# EAGLE board Motor_Board-Rev5.2.b (EAGLE 6.2), part 1 of 2
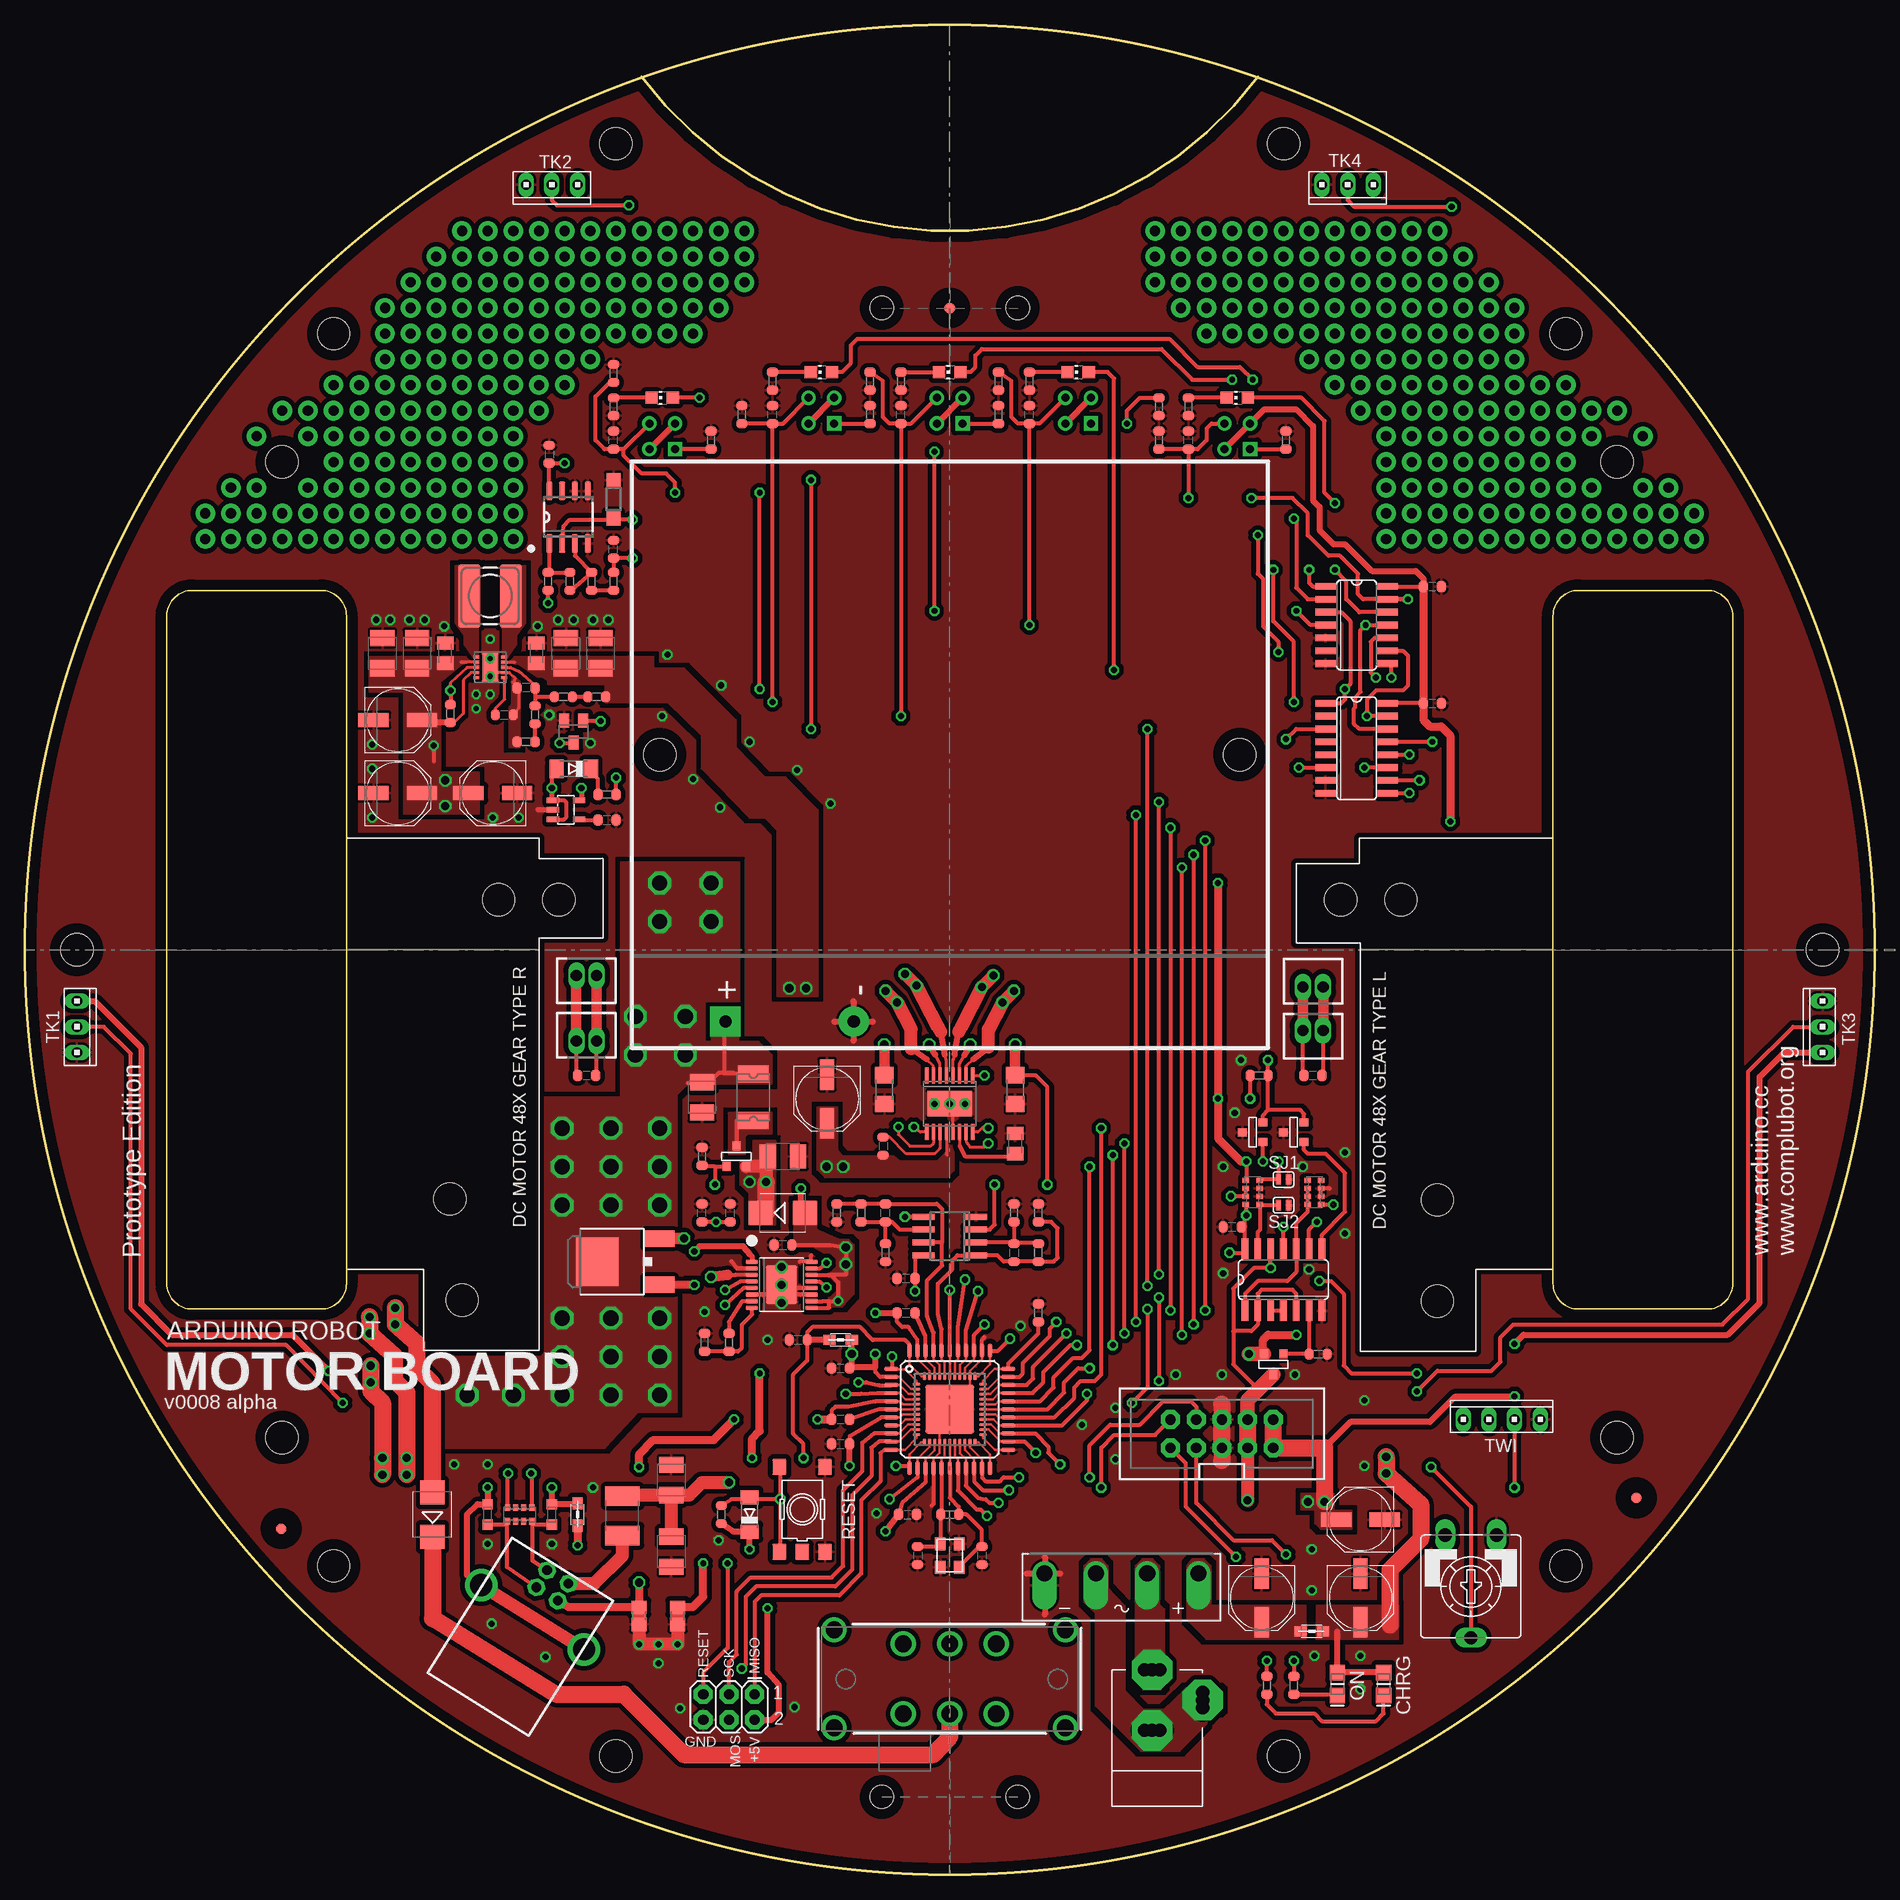
[diagram p2: board, top side]
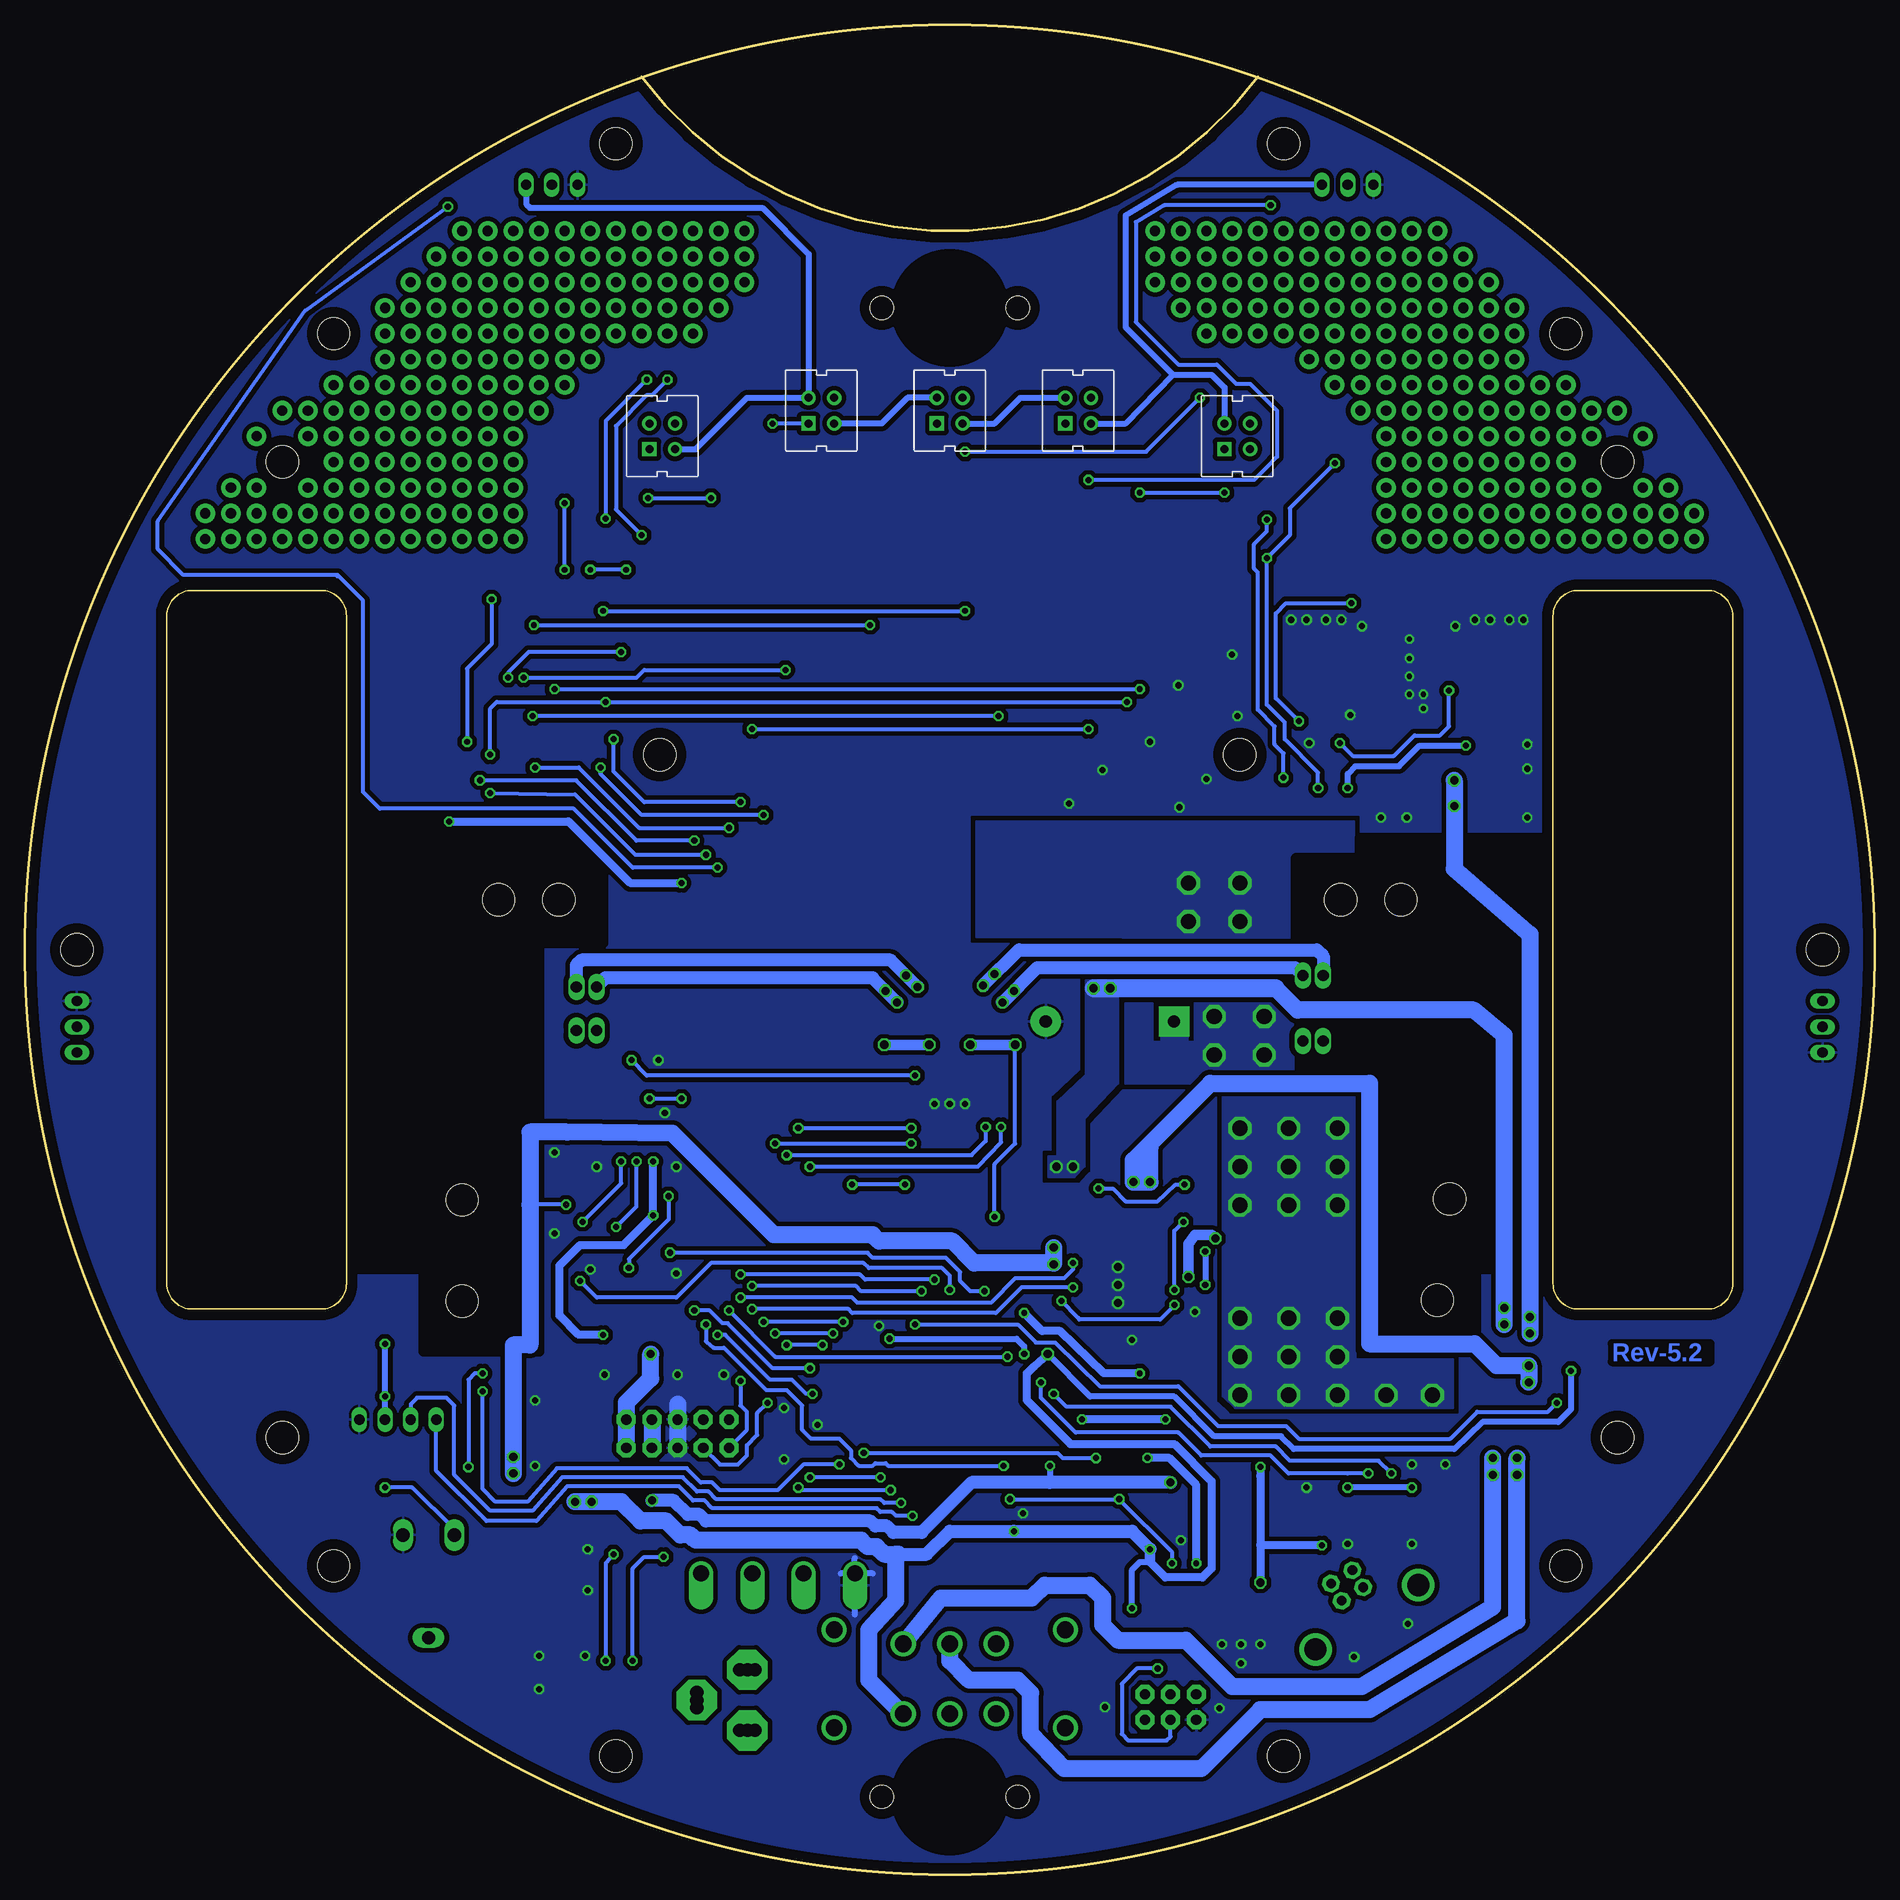
[diagram p3: board, bottom side, seen from below]

Size 182.94 x 182.94 mm. Coordinates in mm from the lower left corner, seen from the top.
Outline: 121.95,177.83 arc-106 60.99,177.83
Outline: circle at 91.47,91.47 radius 91.47
Copper layers (1*16): Top 0.035mm / dielectric 1.5mm / Bottom 0.035mm
Design rules: minimum track width 10mil, minimum drill 23mil, track to track 8mil, track to pad 8mil, pad to pad 8mil, via to via 10mil, smd to smd 8mil, copper to edge 40mil, drill to drill 8mil, minimum pad ring 10mil, minimum via ring 8mil, stop-mask expansion 2mil, vias tented up to drill 30mil, thermal gap 10mil
Net classes: 0 default: width 0.254 mm, drill 0.584 mm, clearance 0.203 mm; 1 power: width 0.254 mm, drill 0.584 mm, clearance 0.203 mm; 2 gnd: width 0.254 mm, drill 0.584 mm, clearance 0.203 mm; 3 usbvcc: width 0.254 mm, drill 0.584 mm, clearance 0.203 mm; 5 +5v: width 0.254 mm, drill 0.584 mm, clearance 0.203 mm
tRestrict: area 45.4,124 to 46.6,129.4; area 45.4,123.9 to 46.6,129.3; area 87.2,41.6 to 93.2,50.4; area 90.6,41.6 to 95.9,50.4; 5 lines

## Footprints (pad centres in the part's own frame; a part is rotated, then mirrored left to right if it is on the bottom)
KBL = drill 1.6 offset: + -7.62,-1.27; - 7.62,-1.27; AC1 2.54,-1.27; AC2 -2.54,-1.27
BALL_BEARING_LOTTIE_LEMON = hole 2.286: -6.731,0; 6.731,0
C0603-ROUND = smd 0.898 x 1.1: 1 -0.889,0; 2 0.889,0
PANASONIC_D = smd 3 x 1.4: + 2.4,0; - -2.4,0
C0805K = smd 1.3 x 1.6: 1 -1,0; 2 1,0
SMC_B = smd 1.6 x 2.4: + -1.5,0; - 1.5,0
SMD_LED0805 = smd 1.524 x 1.524: 1 0,0; 2 2.286,0
MINIMELF = smd 1.4 x 1.8: A 1.7,0; C -1.7,0
SMB = smd 2.4 x 2.4: A 2.2,0; C -2.2,0
SOD123 = smd 1.4 x 1.4: A 1.9,0; C -1.9,0
L1812 = smd 1.9 x 3.4: 1 -1.95,0; 2 1.95,0
FIDUCIA-MOUNT = smd 1.016 x 1.016: P$1 0,0
MF-MSMF-S2 = smd 1.7 x 3: P$1 -2.3,0; P$2 2.3,0
4 = drill 0.8 pad 1.422: A -1.27,1.27; C 1.27,-1.27; E 1.27,1.27 | drill 0.8 pad 1.422 square: K -1.27,-1.27
4XAA_BATTERY-HOLDER = drill 1.2 pad 3 square: 1 26.4,-22.2 | drill 1.2 pad 3: 2 26.4,-9.5 | hole 3.2: 0,28.7; 0,-28.7
SO14 = smd 0.66 x 2.032: 1 -3.81,-3.073; 2 -2.54,-3.073; 3 -1.27,-3.073; 4 0,-3.073; 5 1.27,-3.073; 6 2.54,-3.073; 7 3.81,-3.073; 8 3.81,3.073; 9 2.54,3.073; 10 1.27,3.073; 11 0,3.073; 12 -1.27,3.073; 13 -2.54,3.073; 14 -3.81,3.073
R-PDSO-G16 = smd 0.3 x 1.6: P$1 -2.275,-2.8; P$2 -1.625,-2.8; P$3 -0.975,-2.8; P$4 -0.325,-2.8; P$5 0.325,-2.8; P$6 0.975,-2.8; P$7 1.625,-2.8; P$8 2.275,-2.8; P$9 2.275,2.8; P$10 1.625,2.8; P$11 0.975,2.8; P$12 0.325,2.8; P$13 -0.325,2.8; P$14 -0.975,2.8; P$15 -1.625,2.8; P$16 -2.275,2.8 | smd 4.4 x 2.5: P$17 0,0
SO16 = smd 0.66 x 2.032: 1 -4.445,-3.073; 2 -3.175,-3.073; 3 -1.905,-3.073; 4 -0.635,-3.073; 5 0.635,-3.073; 6 1.905,-3.073; 7 3.175,-3.073; 8 4.445,-3.073; 9 4.445,3.073; 10 3.175,3.073; 11 1.905,3.073; 12 0.635,3.073; 13 -0.635,3.073; 14 -1.905,3.073; 15 -3.175,3.073; 16 -4.445,3.073
SO08 = smd 0.6 x 2.2: 1 -1.905,-2.6; 2 -0.635,-2.6; 3 0.635,-2.6; 4 1.905,-2.6; 5 1.905,2.6; 6 0.635,2.6; 7 -0.635,2.6; 8 -1.905,2.6
SO08' = smd 0.6 x 1.8: 1 -1.905,-2.6; 2 -0.635,-2.6; 3 0.635,-2.6; 4 1.905,-2.6; 5 1.905,2.6; 6 0.635,2.6; 7 -0.635,2.6; 8 -1.905,2.6
SOT23-DBV = smd 0.55 x 1.2: 1 -0.95,-1.3; 2 0,-1.3; 3 0.95,-1.3; 4 0.95,1.3; 5 -0.95,1.3
TSSOP16 = smd 0.45 x 1.2: 1 -2.275,-2.95; 2 -1.625,-2.95; 3 -0.975,-2.95; 4 -0.325,-2.95; 5 0.325,-2.95; 6 0.975,-2.95; 7 1.625,-2.95; 8 2.275,-2.95; 9 2.275,2.95; 10 1.625,2.95; 11 0.975,2.95; 12 0.325,2.95; 13 -0.325,2.95; 14 -0.975,2.95; 15 -1.625,2.95; 16 -2.275,2.95 | smd 3.8 x 3.1: TPAD 0,0
R-PVSON-10N = smd 0.3 x 0.65: 1 -1,-1.375; 2 -0.5,-1.375; 3 0,-1.375; 4 0.5,-1.375; 5 1,-1.375; 6 1,1.375; 7 0.5,1.375; 8 0,1.375; 9 -0.5,1.375; 10 -1,1.375 | smd 3 x 1.6: PAD 0,0
2X3 = drill 1.016 pad 1.88 octagon: 1 0,0; 2 0,2.54; 3 2.54,0; 4 2.54,2.54; 5 5.08,0; 6 5.08,2.54
POWERSUPPLY_DC-21MM = drill 1.3 pad 4 octagon: 1 -5.08,-3.353; 2 -0.076,-6.35; 3 -0.076,-0.356 | drill 1.3: 4 -5.08,-4.115; 5 -5.08,-2.591; 6 -0.838,-0.356; 7 0.686,-0.356; 8 -0.838,-6.35; 9 0.686,-6.35
2X5-SHROUDED_LOCK = drill 1.016 pad 1.88 octagon: 1 -1.397,5.08; 2 1.397,5.08; 3 -1.397,2.54; 4 1.397,2.54; 5 -1.397,0; 6 1.397,0; 7 -1.397,-2.54; 8 1.397,-2.54; 9 -1.397,-5.08; 10 1.397,-5.08
0805 = smd 1.2 x 1: 1 -1.1,0; 2 1.1,0
POWER-CHOKE_WE-TPC = smd 6.3 x 2.2: 1 0,2.05; 2 0,-2.05
CHIP-LED0805 = smd 1.2 x 1.2: A 0,-1.05; C 0,1.05
CARCASA_MOTOR_L_LOTTIE_LEMON = hole 3.2: 21.001,6.115; 11.443,45.812; 11.443,35.804; 15.059,6.115
B2B-PH_KL = drill 1.1 pad 1.5 long: 1 -1,0; 2 1,0
R0805 = smd 1.3 x 1.5: 1 -0.85,0; 2 0.85,0
SOT23 = smd 1 x 1.4: 1 -0.95,-1.1; 2 0.95,-1.1; 3 0,1.1
R0603-ROUND = smd 0.898 x 1.1: 1 -0.889,0; 2 0.889,0
CT/CN0603 = smd 1 x 1: 1 -1,0; 2 1,0
R1206 = smd 1.6 x 1.803: 1 -1.422,0; 2 1.422,0
CA9V = drill 1.321 long: A -2.54,-5.08; E 2.54,-5.08; S 0,5.08
TS42 = smd 1.6 x 1.4: 1 -4.2,2.25; 2 4.2,2.25; 3 -4.2,-2.25; 4 4.2,-2.25; 5 -4.2,0
CAY16 = smd 0.5 x 0.65: 1 -1.2,-0.675; 2 -0.4,-0.675; 3 0.4,-0.675; 4 1.2,-0.675; 5 1.2,0.675; 6 0.4,0.675; 7 -0.4,0.675; 8 -1.2,0.675
CARCASA_MOTOR_R_LOTTIE_LEMON = hole 3.2: -21.001,6.115; -11.443,45.712; -10.243,35.704; -15.059,6.115
GPI-152-3013 = drill 1.65: 10 -4.6,3.455; 11 -4.6,-3.455; 20 4.6,3.455; 21 4.6,-3.455; C@1 0,3.455; C@2 0,-3.455; P$7 11.43,4.85; P$8 -11.43,4.85; P$9 -11.43,-4.85; P$10 11.43,-4.85
SJL = smd 0.508 x 1.016: 1 -0.508,0; 2 0.508,0
SOT-23 = smd 0.787 x 0.889: 1 0.025,-1.016; 2 -0.94,1.016; 3 0.991,1.016
DPAK = smd 1.6 x 3: 1 -2.28,-4.04; 3 2.28,-4.04 | smd 4.826 x 4.191: 4 0,2.096
10X03MTA = drill 1.016 long: 1 2.54,0; 2 0,0; 3 -2.54,0
10X04MTA = drill 1.016 long: 1 3.81,0; 2 1.27,0; 3 -1.27,0; 4 -3.81,0
QFN44ML7X7 = smd 0.75 x 0.3: 1 -3.275,2.5; 2 -3.275,2; 3 -3.275,1.5; 4 -3.275,1; 5 -3.275,0.5; 6 -3.275,0; 7 -3.275,-0.5; 8 -3.275,-1; 9 -3.275,-1.5; 10 -3.275,-2; 11 -3.275,-2.5; 23 3.275,-2.5; 24 3.275,-2; 25 3.275,-1.5; 26 3.275,-1; 27 3.275,-0.5; 28 3.275,0; 29 3.275,0.5; 30 3.275,1; 31 3.275,1.5; 32 3.275,2; 33 3.275,2.5 | smd 0.3 x 0.75: 12 -2.5,-3.275; 13 -2,-3.275; 14 -1.5,-3.275; 15 -1,-3.275; 16 -0.5,-3.275; 17 0,-3.275; 18 0.5,-3.275; 19 1,-3.275; 20 1.5,-3.275; 21 2,-3.275; 22 2.5,-3.275; 34 2.5,3.275; 35 2,3.275; 36 1.5,3.275; 37 1,3.275; 38 0.5,3.275; 39 0,3.275; 40 -0.5,3.275; 41 -1,3.275; 42 -1.5,3.275; 43 -2,3.275; 44 -2.5,3.275 | smd 4.826 x 4.826: EXP 0,0
TQFP44-PAD = smd 1.4 x 0.45: 1 -5.8,4; 2 -5.8,3.2; 3 -5.8,2.4; 4 -5.8,1.6; 5 -5.8,0.8; 6 -5.8,0; 7 -5.8,-0.8; 8 -5.8,-1.6; 9 -5.8,-2.4; 10 -5.8,-3.2; 11 -5.8,-4; 23 5.8,-4; 24 5.8,-3.2; 25 5.8,-2.4; 26 5.8,-1.6; 27 5.8,-0.8; 28 5.8,0; 29 5.8,0.8; 30 5.8,1.6; 31 5.8,2.4; 32 5.8,3.2; 33 5.8,4 | smd 0.45 x 1.4: 12 -4,-5.8; 13 -3.2,-5.8; 14 -2.4,-5.8; 15 -1.6,-5.8; 16 -0.8,-5.8; 17 0,-5.8; 18 0.8,-5.8; 19 1.6,-5.8; 20 2.4,-5.8; 21 3.2,-5.8; 22 4,-5.8; 34 4,5.8; 35 3.2,5.8; 36 2.4,5.8; 37 1.6,5.8; 38 0.8,5.8; 39 0,5.8; 40 -0.8,5.8; 41 -1.6,5.8; 42 -2.4,5.8; 43 -3.2,5.8; 44 -4,5.8 | smd 1 x 1: P$1 0,0
BASE_ROBOT_001 = hole 3.2: 5.08,91.44; 152.4,152.4; 30.48,152.4; 177.8,91.44; 30.48,30.48; 152.4,30.48; 58.42,171.196; 124.46,171.196; 58.42,11.659; 124.46,11.659; 25.375,139.7; 25.375,43.18; 157.455,139.7; 157.455,43.18
PADS_LOTTIE_LEMON = drill 1 pad 1.93: P$1 0,0; P$2 2.54,0; P$3 0,2.54; P$4 2.54,2.54; P$5 2.54,5.08; P$6 5.08,5.08; P$7 5.08,2.54; P$8 5.08,0; P$9 7.62,0; P$10 7.62,2.54; P$11 10.16,5.08; P$12 10.16,2.54; P$13 10.16,0; P$14 5.08,10.16; P$15 10.16,10.16; P$16 7.62,12.7; P$17 10.16,12.7; P$18 12.7,15.24; P$19 12.7,12.7; P$20 12.7,10.16; P$21 12.7,7.62; P$22 12.7,5.08; P$23 12.7,2.54; P$24 12.7,0; P$25 15.24,15.24; P$26 15.24,12.7; P$27 15.24,10.16; P$28 15.24,7.62; P$29 15.24,5.08; P$30 15.24,2.54; P$31 15.24,0; P$32 17.78,22.86; P$33 17.78,20.32; P$34 17.78,17.78; P$35 17.78,15.24; P$36 17.78,12.7; P$37 17.78,10.16; P$38 17.78,7.62; P$39 17.78,5.08; P$40 17.78,2.54; P$41 17.78,0; P$42 20.32,25.4; P$43 20.32,22.86; P$44 22.86,20.32; P$45 20.32,20.32; P$46 20.32,17.78; P$47 20.32,15.24; P$48 20.32,12.7; P$49 20.32,10.16; P$50 20.32,5.08; P$51 20.32,7.62; P$52 20.32,0; P$53 20.32,2.54; P$54 22.86,27.94; P$55 22.86,25.4; P$56 22.86,22.86; P$57 22.86,17.78; P$58 22.86,15.24; P$59 22.86,12.7; P$60 22.86,10.16; P$61 22.86,7.62; P$62 22.86,5.08; P$63 22.86,2.54; P$64 22.86,0; P$65 25.4,30.48; P$66 25.4,27.94; P$67 25.4,25.4; P$68 25.4,22.86; P$69 25.4,20.32; P$70 25.4,17.78; P$71 25.4,15.24; P$72 25.4,12.7; P$73 25.4,10.16; P$74 25.4,7.62; P$75 25.4,5.08; P$76 25.4,2.54; P$77 25.4,0; P$78 27.94,30.48; P$79 27.94,27.94; P$80 27.94,25.4; P$81 27.94,22.86; P$82 27.94,20.32; P$83 27.94,17.78; P$84 27.94,15.24; P$85 27.94,12.7; P$86 27.94,10.16; P$87 27.94,7.62; P$88 27.94,5.08; P$89 27.94,2.54; P$90 27.94,0; P$91 109.22,30.48; P$92 30.48,30.48; P$93 30.48,27.94; P$94 30.48,25.4; P$95 30.48,22.86; P$96 30.48,17.78; P$97 30.48,20.32; P$98 30.48,12.7; P$99 30.48,15.24; P$100 30.48,10.16; P$101 30.48,7.62; P$102 30.48,5.08; P$103 30.48,2.54; P$104 30.48,0; P$105 106.68,30.48; P$106 33.02,30.48; P$107 33.02,27.94; P$108 33.02,25.4; P$109 33.02,22.86; P$110 33.02,20.32; P$111 33.02,17.78; P$112 106.68,27.94; P$113 35.56,30.48; P$114 35.56,27.94; P$115 35.56,25.4; P$116 35.56,22.86; P$117 35.56,20.32; P$118 38.1,20.32; P$119 38.1,22.86; P$120 38.1,25.4; P$121 38.1,27.94; P$122 38.1,30.48; P$123 106.68,25.4; P$124 40.64,20.32; P$125 40.64,22.86; P$126 40.64,25.4; P$127 40.64,27.94; P$128 40.64,30.48; P$129 106.68,22.86; P$130 43.18,20.32; P$131 43.18,22.86; P$132 43.18,25.4; P$133 43.18,27.94; P$134 43.18,30.48; P$135 104.14,25.4; P$136 45.72,20.32; P$137 45.72,22.86; P$138 45.72,25.4; P$139 45.72,27.94; P$140 45.72,30.48; P$141 104.14,27.94; P$142 48.26,20.32; P$143 48.26,22.86; P$144 48.26,25.4; P$145 48.26,27.94; P$146 48.26,30.48; P$147 101.6,30.48; P$148 50.8,30.48; P$149 50.8,27.94; P$150 50.8,25.4; P$151 50.8,22.86; P$152 104.14,30.48; P$153 53.34,30.48; P$154 53.34,27.94; P$155 53.34,25.4; P$156 101.6,27.94; P$157 101.6,25.4; P$158 104.14,22.86; P$159 109.22,20.32; P$160 106.68,20.32; P$161 99.06,30.48; P$162 99.06,27.94; P$163 99.06,25.4; P$164 96.52,25.4; P$165 96.52,27.94; P$166 93.98,30.48; P$167 96.52,30.48; P$168 93.98,27.94; P$169 93.98,25.4; P$170 101.6,22.86; P$171 99.06,22.86; P$172 96.52,22.86; P$173 99.06,20.32; P$174 111.76,20.32; P$175 101.6,20.32; P$176 104.14,20.32; P$177 114.3,15.24; P$178 111.76,17.78; P$179 111.76,22.86; P$180 111.76,25.4; P$181 109.22,17.78; P$182 111.76,15.24; P$183 114.3,12.7; P$184 33.02,15.24; P$185 35.56,17.78; P$186 38.1,17.78; P$187 35.56,15.24; P$188 33.02,12.7; P$189 111.76,27.94; P$190 111.76,30.48; P$199 109.22,25.4; P$200 109.22,22.86; P$201 114.3,30.48; P$202 114.3,27.94; P$203 114.3,25.4; P$204 114.3,22.86; P$205 114.3,20.32; P$206 114.3,17.78; P$207 109.22,27.94; P$208 116.84,30.48; P$209 116.84,27.94; P$210 116.84,25.4; P$211 116.84,22.86; P$212 116.84,20.32; P$213 116.84,17.78; P$214 116.84,15.24; P$215 116.84,12.7; P$216 116.84,10.16; P$217 116.84,7.62; P$218 116.84,5.08; P$219 116.84,2.54; P$220 116.84,0; P$221 119.38,30.48; P$222 119.38,27.94; P$223 119.38,25.4; P$224 119.38,22.86; P$225 119.38,20.32; P$226 119.38,17.78; P$227 119.38,15.24; P$228 119.38,12.7; P$229 119.38,10.16; P$230 119.38,7.62; P$231 119.38,5.08; P$232 119.38,2.54; P$233 119.38,0; P$234 121.92,30.48; P$235 121.92,27.94; P$236 121.92,25.4; P$237 121.92,22.86; P$238 121.92,20.32; P$239 121.92,17.78; P$240 121.92,15.24; P$241 121.92,12.7; P$242 121.92,10.16; P$243 121.92,7.62; P$244 121.92,5.08; P$245 121.92,2.54; P$246 121.92,0; P$247 124.46,27.94; P$248 124.46,25.4; P$249 124.46,22.86; P$250 124.46,20.32; P$251 124.46,15.24; P$252 124.46,17.78; P$253 124.46,12.7; P$254 124.46,10.16; P$255 124.46,7.62; P$256 124.46,5.08; P$257 124.46,2.54; P$258 124.46,0; P$259 127,25.4; P$260 127,22.86; P$261 127,20.32; P$262 127,17.78; P$263 127,15.24; P$264 127,12.7; P$265 127,10.16; P$266 127,7.62; P$267 127,5.08; P$268 127,2.54; P$269 127,0; P$270 129.54,22.86; P$271 129.54,20.32; P$272 129.54,17.78; P$273 129.54,15.24; P$274 129.54,12.7; P$275 129.54,10.16; P$276 129.54,7.62; P$277 129.54,5.08; P$278 129.54,2.54; P$279 129.54,0; P$280 132.08,15.24; P$281 132.08,12.7; P$282 132.08,10.16; P$283 132.08,7.62; P$284 132.08,5.08; P$285 132.08,2.54; P$286 132.08,0; P$287 134.62,15.24; P$288 134.62,12.7; P$289 134.62,10.16; P$290 134.62,7.62; P$291 134.62,5.08; P$292 134.62,2.54; P$293 134.62,0; P$294 137.16,12.7; P$295 137.16,10.16; P$296 137.16,5.08; P$297 137.16,2.54; P$298 137.16,0; P$299 139.7,12.7; P$300 139.7,2.54; P$301 139.7,0; P$302 142.24,10.16; P$303 142.24,5.08; P$304 142.24,2.54; P$305 142.24,0; P$306 144.78,5.08; P$307 144.78,2.54; P$308 144.78,0; P$309 147.32,2.54; P$310 147.32,0
CRYSTAL-3.2-2.5 = smd 1.3 x 1.05: 1 -1.15,-0.925; 2 1.15,-0.925; 3 1.15,0.925; 4 -1.15,0.925
PN61729 = drill 0.95 pad 1.676 octagon: 1 1.25,4.71; 2 -1.25,4.71; 3 -1.25,2.71; 4 1.25,2.71 | drill 2.2: P$1 -6,0; P$2 6,0

## Placement (x,y rotation side)
B2  [KBL]  108.46,28.5 180 top
BB1  LOTTIE_LEMON_BALL_BEARING  [BALL_BEARING_LOTTIE_LEMON]  91.47,154.97 0 top
BB2  LOTTIE_LEMON_BALL_BEARING  [BALL_BEARING_LOTTIE_LEMON]  91.47,7.65 0 top
C1  100n  [C0603-ROUND]  87.28,35.59 0 top
C2  22p  [C0603-ROUND]  88.29,31.53 270 top
C3  1n  [C0603-ROUND]  115.09,141.89 90 top
C4  22p  [C0603-ROUND]  94.64,31.53 270 top
C5  100n  [C0603-ROUND]  87.15,55.53 180 top
C6  100n  [C0603-ROUND]  80.67,50.07 0 top
C7  1n  [C0603-ROUND]  73.94,144.43 90 top
C8  1u  [C0603-ROUND]  76.48,52.86 180 top
C9  1u  [C0603-ROUND]  80.67,44.99 180 top
C10  1n  [C0603-ROUND]  99.34,144.43 90 top
C11  10n  [C0603-ROUND]  84.87,72.04 270 top
C12  1n  [C0603-ROUND]  58.2,141.89 90 top
C13  47u/25v  [PANASONIC_D]  79.32,76.72 270 top
C14  2,2u  [C0805K]  97.95,72.29 90 top
C15  1n  [C0603-ROUND]  86.64,144.43 90 top
C16  330n  [C0603-ROUND]  97.82,61.5 270 top
C17  330n  [C0603-ROUND]  85.12,65.43 90 top
C18  10uF/10v  [SMC_B]  35.34,120.81 90 top
C19  10uF/10v  [SMC_B]  38.76,120.81 90 top
C20  2.2u  [C0805K]  41.56,120.81 90 top
C21  100n  [C0603-ROUND]  47.4,114.71 0 top
C22  10uF/10v  [SMC_B]  53.5,120.81 90 top
C23  10uF/10v  [SMC_B]  56.93,120.81 90 top
C24  2.2u  [C0805K]  50.58,120.81 90 top
C25  22uF/10v  [SMC_B]  63.91,39.02 90 top
C26  22uF/10v  [SMC_B]  63.91,31.91 270 top
C27  47u/25v  [PANASONIC_D]  132.11,35.08 180 top
C28  100n  [C0603-ROUND]  51.85,140.49 270 top
C29  100n  [C0603-ROUND]  139.22,127.41 0 top
C30  100n  [C0603-ROUND]  139.22,115.85 0 top
C31  100n  [C0603-ROUND]  119.41,64.04 180 top
C32  100n  [C0603-ROUND]  80.67,42.57 0 top
C33  100n  [C0603-ROUND]  87.15,58.96 0 top
C34  47u/25v  [PANASONIC_D]  36.86,114.2 0 top
C35  47u/25v  [PANASONIC_D]  36.86,106.96 0 top
C36  47u/25v  [PANASONIC_D]  46.26,106.96 180 top
C37  47u/25v  [PANASONIC_D]  122.33,27.33 270 top
C38  47u/25v  [PANASONIC_D]  132.11,27.33 270 top
C39  1u  [C0603-ROUND]  74.96,62.26 0 top
C40  10uF/10v  [SMC_B]  74.96,71.02 0 top
C41  1n  [C0603-ROUND]  69.75,65.43 90 top
C42  360p  [C0603-ROUND]  66.96,65.43 90 top
C44  1u  [C0603-ROUND]  58.2,131.09 90 top
C45  10n  [C0603-ROUND]  57.56,104.3 0 top
CHRG  YELLOW  [SMD_LED0805]  134.4,17.68 90 top
CM1  1n  [C0603-ROUND]  127.41,79.02 180 top
CM2  1n  [C0603-ROUND]  55.53,79.02 180 top
D1  CD1206-S01575  [MINIMELF]  71.66,35.59 90 top
D2  SS14  [SMB]  40.29,35.59 90 top
D3  SS14  [SMB]  74.96,65.43 0 top
D4  CD1206-S01575  [MINIMELF]  54.26,109.38 180 top
DZ1  BZT52H-B3V6  [SOD123]  58.2,136.05 90 top
F1  500mA  [L1812]  59.08,35.46 90 top
FM1  FIDUCIALMOUNT  [FIDUCIA-MOUNT]  91.47,154.97 0 top
FM2  FIDUCIALMOUNT  [FIDUCIA-MOUNT]  159.41,37.24 0 top
FM3  FIDUCIALMOUNT  [FIDUCIA-MOUNT]  25.3,34.19 0 top
FR1  2.5A  [MF-MSMF-S2]  72.04,76.86 270 top
FS1  CNY70  [4]  119.92,142.27 0 bottom
FS2  CNY70  [4]  78.77,144.81 0 bottom
FS3  CNY70  [4]  104.17,144.81 0 bottom
FS4  CNY70  [4]  63.02,142.27 0 bottom
FS5  CNY70  [4]  91.47,144.81 0 bottom
HB  KEYSTONE-2477RB  [4XAA_BATTERY-HOLDER]  91.47,110.77 270 top
IC1  74HC14D  [SO14]  131.73,123.6 270 top
IC2  DRV8833PWPR  [R-PDSO-G16]  91.47,76.23 180 top
IC3  4051D  [SO16]  131.73,111.41 270 top
IC4  LMV358IDR  [SO08]  91.47,63.15 90 top
IC5  LMV358IDG  [SO08']  53.75,134.27 0 top
IC6  LP2985-XXDBVR33  [SOT23-DBV]  53.5,105.31 270 top
IC7  74HCT132D  [SO14]  124.49,58.83 0 top
IC8  LTC4060EFE  [TSSOP16]  74.83,58.32 270 top
IC9  TPS63060  [R-PVSON-10N]  46,119.41 270 top
J1  MOLEX - 90130-3206 - HEADER, RIGHT ANGLE, 2ROW, 6WAY  [2X3]  72.17,17.81 180 top
JP1  POWERSUPPLY_DC21MMX  [POWERSUPPLY_DC-21MM]  111.41,13.87 180 top
JP2  M05X2SHD_LOCK/MULTICOMP - MC9A12-1034 - HEADER, STRAIGHT  [2X5-SHROUDED_LOCK]  118.39,43.59 90 top
L1  MH2029-300Y  [0805]  80.67,52.86 180 top
L2  MH2029-300Y  [0805]  54.64,35.59 270 top
L3  1,5uH/4A  [POWER-CHOKE_WE-TPC]  46,126.47 90 top
L4  MH2029-300Y  [0805]  127.28,24.03 0 top
LED1  RED  [CHIP-LED0805]  119.92,146.08 90 top
LED2  RED  [CHIP-LED0805]  78.77,148.62 90 top
LED3  RED  [CHIP-LED0805]  104.17,148.62 90 top
LED4  RED  [CHIP-LED0805]  63.02,146.08 90 top
LED5  RED  [CHIP-LED0805]  91.47,148.62 90 top
LL1  LOTTIE_LEMON_DC_MOTOR_48X_L  [CARCASA_MOTOR_L_LOTTIE_LEMON]  151.16,102.52 180 top
MA  B2B-PH-K-S(LF)(SN)  [B2B-PH_KL]  127.41,87.79 0 top
MB  B2B-PH-K-S(LF)(SN)  [B2B-PH_KL]  55.53,88.93 180 top
NM  10uF/10v  [SMC_B]  66.96,76.86 270 top
NM1  B2B-PH-K-S(LF)(SN)  [B2B-PH_KL]  127.41,83.47 180 top
NM2  B2B-PH-K-S(LF)(SN)  [B2B-PH_KL]  55.53,82.45 0 top
NM3  0R  [R0805]  60.74,25.56 270 top
NM4  0R  [R0805]  64.55,25.56 270 top
NM5  12p  [C0603-ROUND]  49.56,117.38 180 top
ON  GREEN  [SMD_LED0805]  129.82,17.68 90 top
Q1  BC847BSMD  [SOT23]  54.26,113.06 180 top
R1  10K  [R0603-ROUND]  68.86,35.59 270 top
R2  220  [R0603-ROUND]  124.74,141.89 270 top
R3  47K  [R0603-ROUND]  112.17,141.89 270 top
R4  1M  [R0603-ROUND]  91.47,35.59 0 top
R5  470  [R0603-ROUND]  115.09,145.19 90 top
R6  10K  [R0603-ROUND]  100.23,55.53 270 top
R7  220  [R0603-ROUND]  83.6,144.43 270 top
R8  47K  [R0603-ROUND]  70.9,144.43 270 top
R9  470  [R0603-ROUND]  73.94,147.73 90 top
R10  VARISTORCN0603  [CT/CN0603]  52.1,35.59 90 top
R11  VARISTORCN0603  [CT/CN0603]  45.75,35.59 90 top
R12  10K  [R0603-ROUND]  57.56,106.84 180 top
R13  220  [R0603-ROUND]  112.17,145.19 90 top
R14  47K  [R0603-ROUND]  96.3,147.73 90 top
R15  470  [R0603-ROUND]  99.34,147.73 90 top
R16  2K  [R0603-ROUND]  122.08,79.02 180 top
R17  220  [R0603-ROUND]  67.85,141.89 270 top
R18  47K  [R0603-ROUND]  58.2,148.49 270 top
R19  470  [R0603-ROUND]  58.2,145.19 90 top
R20  0R33  [R1206]  84.99,77.63 90 top
R21  0R33  [R1206]  97.95,77.63 90 top
R22  220  [R0603-ROUND]  96.3,144.43 270 top
R23  47K  [R0603-ROUND]  83.6,147.73 90 top
R24  470  [R0603-ROUND]  86.64,147.73 90 top
R25  47K 1%  [R0603-ROUND]  100.23,61.5 90 top
R26  47K 1%  [R0603-ROUND]  82.71,65.43 270 top
R27  47K  [R0603-ROUND]  100.23,65.43 270 top
R28  47K  [R0603-ROUND]  80.29,65.43 90 top
R29  1K  [R0603-ROUND]  58.2,127.92 90 top
R30  2K 1%  [R0603-ROUND]  97.82,65.43 270 top
R31  2K 1%  [R0603-ROUND]  85.12,61.5 90 top
R32  100R  [R0603-ROUND]  56.04,127.92 270 top
R33  1M  [R0603-ROUND]  56.54,116.49 180 top
R34  1K  [R0603-ROUND]  51.72,127.92 90 top
R35  10K  [R0603-ROUND]  53.88,127.92 270 top
R36  100K  [R0603-ROUND]  50.45,114.71 270 top
R37  10K  [R0603-ROUND]  49.56,112.04 0 top
R38  10K  [R0603-ROUND]  66.96,71.02 90 top
R39  2K  [R0603-ROUND]  122.84,18.7 270 top
R40  2K  [R0603-ROUND]  125.51,18.7 270 top
R41  10K  [R0603-ROUND]  127.92,51.46 180 top
R42  360R  [R0603-ROUND]  69.63,52.61 90 top
R43  1K2  [R0603-ROUND]  67.21,52.61 270 top
R44  [CA9V]  143.03,28.48 180 top
R45  1K  [R0603-ROUND]  42.07,114.84 90 top
R46  100K  [R0603-ROUND]  53.24,116.49 0 top
RESET  TS42  [TS42]  76.86,36.1 90 top
RN1  22R  [CAY16]  48.92,35.59 0 top
RN2  10K  [CAY16]  127.54,67.47 90 top
RN3  10K  [CAY16]  121.44,67.47 90 top
RR1  LOTTIE_LEMON_DC_MOTOR_48X_R  [CARCASA_MOTOR_R_LOTTIE_LEMON]  31.78,102.52 180 top
S1  SWITCH-DPDTGPI  [GPI-152-3013]  91.47,19.33 180 top
SJ1  [SJL]  124.49,68.74 0 top
SJ2  [SJL]  124.49,66.2 0 top
T1  FDN340P  [SOT-23]  125.51,73.44 270 top
T2  FDN340P  [SOT-23]  121.44,73.44 270 top
T3  FDN340P  [SOT-23]  123.47,50.45 0 top
T4  PMV48XP  [SOT-23]  70.39,71.02 180 top
T5  MJD210  [DPAK]  58.7,60.61 90 top
TK1  [10X03MTA]  5.11,83.85 270 top
TK2  [10X03MTA]  52.1,167.16 180 top
TK3  [10X03MTA]  177.83,83.85 90 top
TK4  [10X03MTA]  130.84,167.16 180 top
TWI  [10X04MTA]  146.08,44.99 0 top
U1  ATMEGA32U4-MU  [QFN44ML7X7]  91.47,46 0 top
U2  ATMEGA32U4-AU  [TQFP44-PAD]  91.47,46 0 top
U$1  LOTTIE_LEMON_BASE_TYPE  [BASE_ROBOT_001]  0.03,0.03 0 top
U$2  LOTTIE_LEMON_PADS  [PADS_LOTTIE_LEMON]  17.81,132.11 0 top
W1  LOTTIE_LEMON_WHEEL  [WHEEL_LOTTIE_LEMON]  14,55.91 0 top
W2  LOTTIE_LEMON_WHEEL  [WHEEL_LOTTIE_LEMON]  151.16,55.91 0 top
X1  16MHz  [CRYSTAL-3.2-2.5]  91.47,31.53 90 top
X2  USB  [PN61729]  50.19,25.43 328 top